# Altium schematic sheet DCDC_TPS5401_3V3.SchDoc
size A4
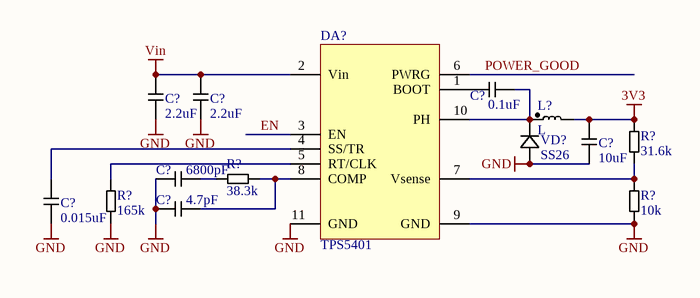
[diagram p0: DCDC_TPS5401_3V3.SchDoc]

## Parts
(Parts that share a designator on the sheet are numbered #1, #2 ... from top to bottom, then left to right.)
C?#1  0.1uF  [C0603]
C?#2  2.2uF  [C0603]
C?#3  2.2uF  [C0603]
C?#4  10uF  [C0603]
C?#5  6800pF  [C0603]
C?#6  0.015uF  [C0603]
C?#7  4.7pF  [C0603]
DA?  TPS5401  [MSOP-10EP]
L?  L  [NR60]
R?#1  31.6k  [R0603]
R?#2  38.3k  [R0603]
R?#3  165k  [R0603]
R?#4  10k  [R0603]
VD?  SS26  [DO214]

## Nets
3V3: C?#4.1 L?.2 R?#1.2
GND: C?#2.1 C?#3.1 C?#4.2 C?#5.1 C?#6.2 C?#7.1 DA?.9(GND) DA?.11(GND) R?#3.1 R?#4.1 VD?.1(K)
Vin: C?#2.2 C?#3.2 DA?.2(Vin)
EN: DA?.3(EN)
POWER_GOOD: DA?.6(PWRG)
NetC?#1_1: C?#1.1 DA?.1(BOOT)
NetC?#1_2: C?#1.2 DA?.10(PH) L?.1 VD?.2(A)
NetC?#5_2: C?#5.2 R?#2.2
NetC?#6_1: C?#6.1 DA?.4(SS/TR)
NetC?#7_2: C?#7.2 DA?.8(COMP) R?#2.1
NetDA?_5: DA?.5(RT/CLK) R?#3.2
NetDA?_7: DA?.7(Vsense) R?#1.1 R?#4.2

## Library data of the parts
C?#1-C?#7 = C: Capacitor
DA? = TPS5401: TI DC-DC converter 0.4A
L? = L: Inductor
R?#1-R?#4 = R: Resistor
VD? = Diode: SMD diode